# EAGLE schematic wifilights-probe-board (EAGLE 7.2.0)
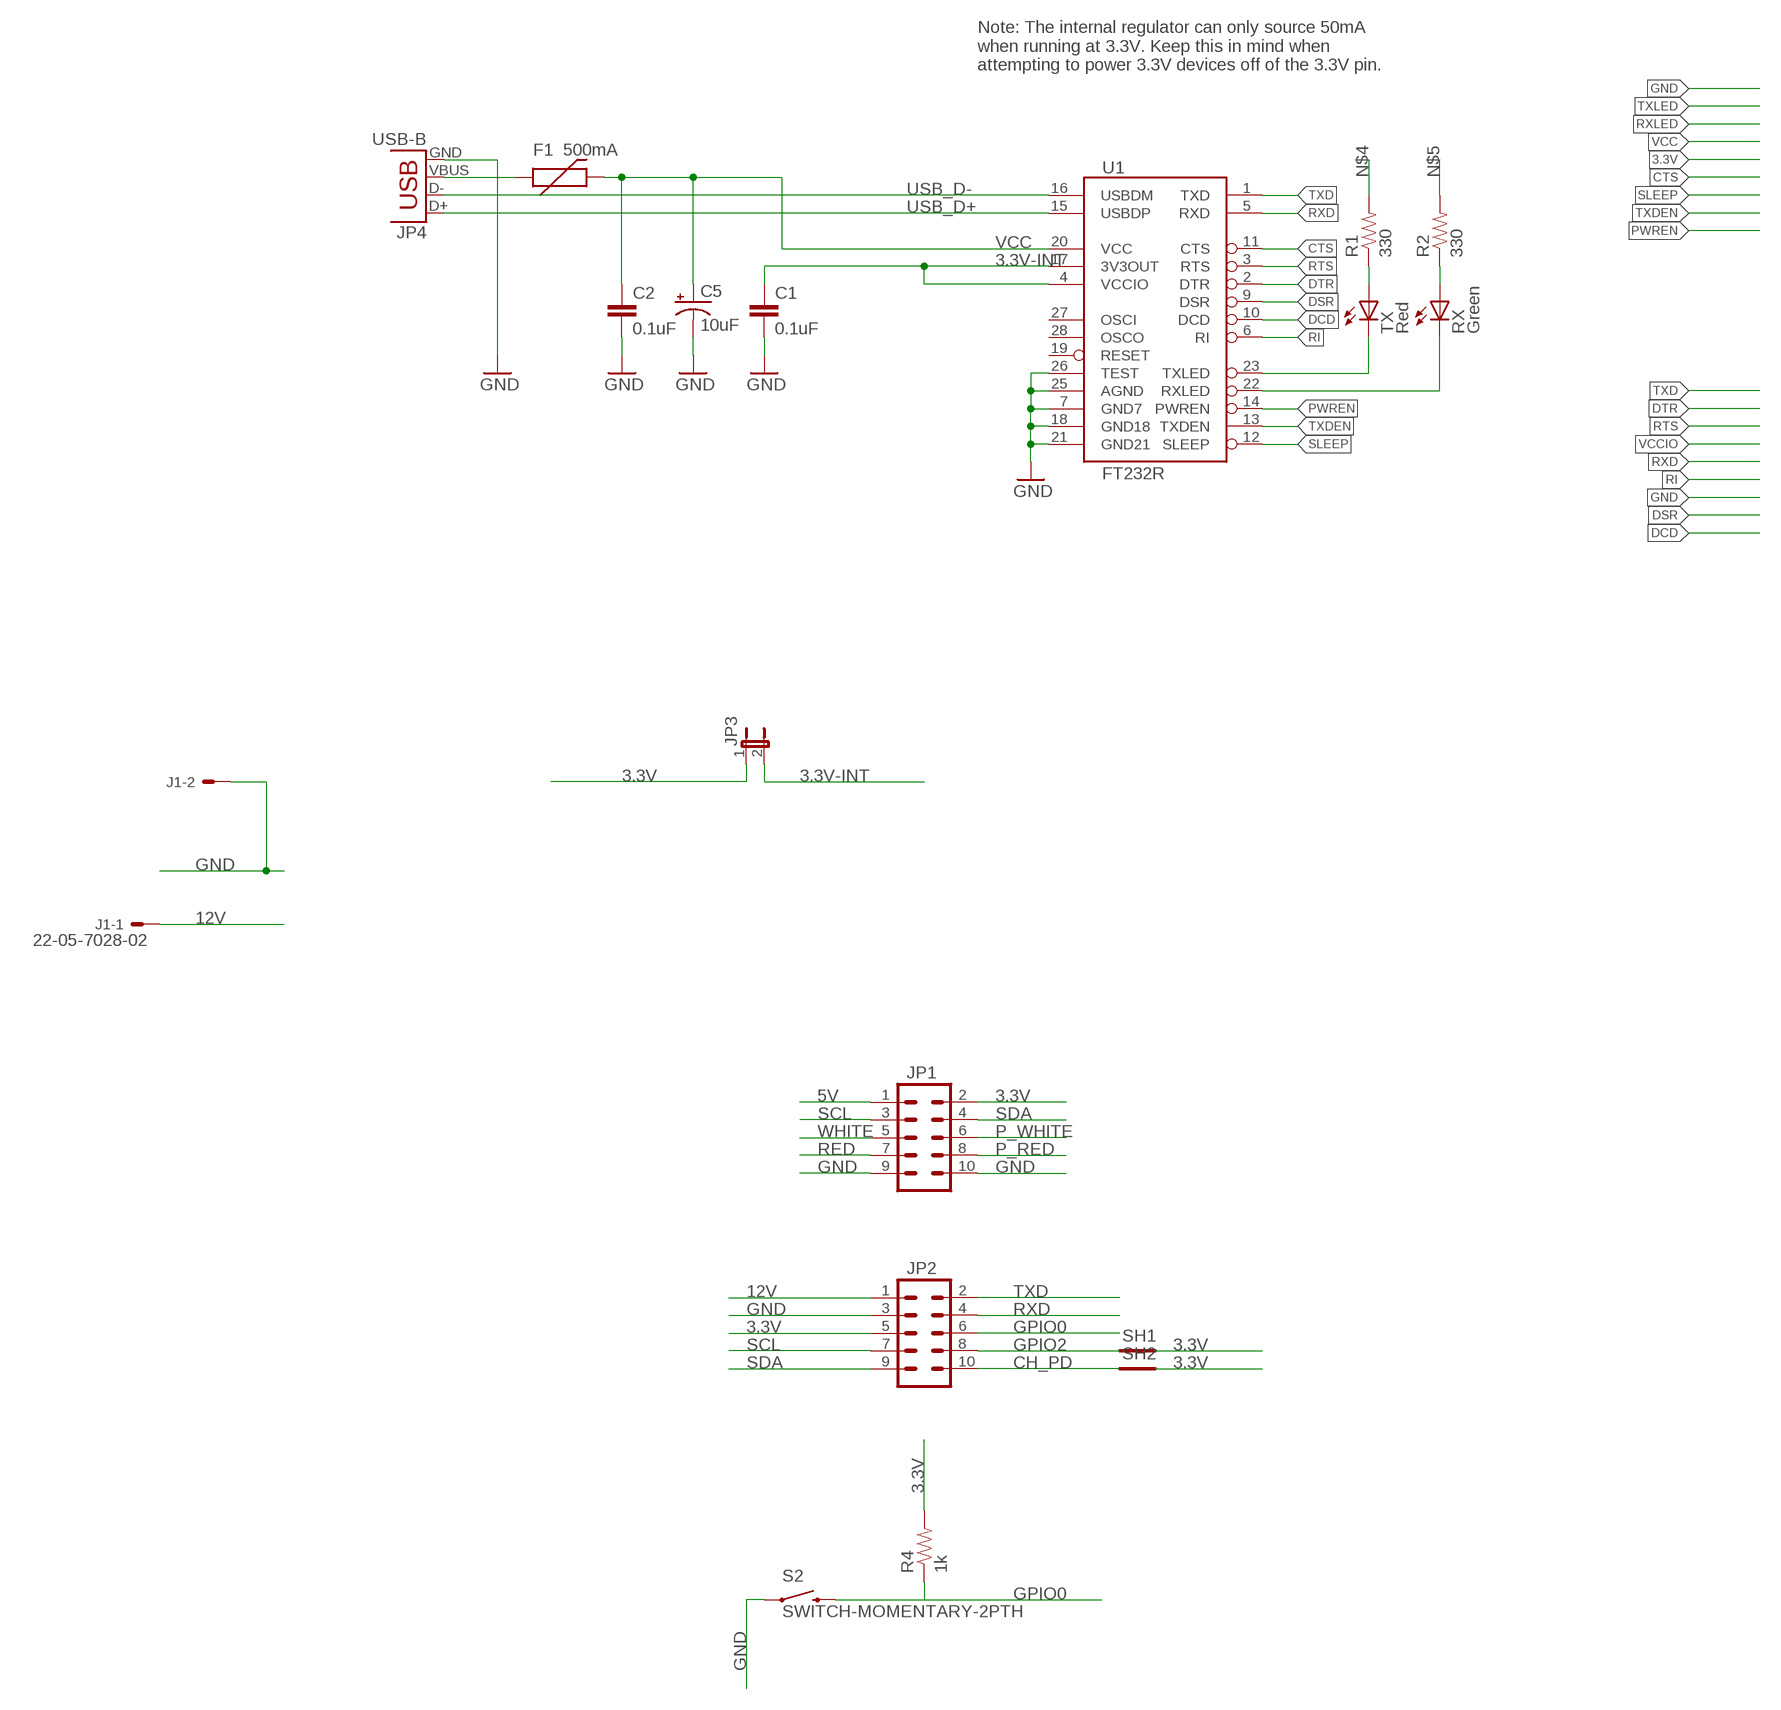
[diagram p0: schematic, sheet 1]

## Parts
C1  0.1uF  0.1UF-25V(+80/-20%)(0603)  [0603-CAP]
C2  0.1uF  0.1UF-25V(+80/-20%)(0603)  [0603-CAP]
C5  10uF  10UF-16V-10%(TANT)  [EIA3216]
F1  500mA  PTCSMD  [PTC-1206]
J1  22-05-7028-02  [7395-02]
JP1  M05X2SHD  [2X5-SHROUDED]
JP2  M05X2SHD_LOCK  [2X5-SHROUDED_LOCK]
JP3  JUMPER-2PTH  [1X02]
JP4  USB-B  USBPTH  [USB-B-PTH]
R1  330  330OHM1/10W1%(0603)  [0603-RES]
R2  330  330OHM1/10W1%(0603)  [0603-RES]
R4  1k  RESISTORAXIAL-0.3  [AXIAL-0.3]
RX  Green  LED-GREEN0603  [LED-0603]
S2  SWITCH-MOMENTARY-2PTH  [TACTILE-PTH]
SH1  SHORT-HT5  [SHORT_TOP-50]
SH2  SHORT-HT5  [SHORT_TOP-50]
TX  Red  LED-RED0603  [LED-0603]
U1  FT232R  FT232RLSSOP  [SSOP28DB]

## Nets
3.3V: JP1.2 JP2.5 JP3.1 R4.P$2 SH1.2 SH2.2
3.3V-INT: C1.1 JP3.2 U1.4(VCCIO) U1.17(3V3OUT)
5V: JP1.1
12V: J1.1 JP2.1
CH_PD: JP2.10 SH2.1
CTS: U1.11(CTS)
DCD: U1.10(DCD)
DSR: U1.9(DSR)
DTR: U1.2(DTR)
GND: C1.2 C2.2 C5.C(-) J1.2 JP1.9 JP1.10 JP2.3 JP4.GND S2.1 U1.7(GND7) U1.18(GND18) U1.21(GND21) U1.25(AGND) U1.26(TEST)
GPIO0: JP2.6 R4.P$1 S2.3
GPIO2: JP2.8 SH1.1
N$1: R1.1 TX.A
N$2: R2.1 RX.A
N$3: F1.1 JP4.VBUS
N$4: R1.2
N$5: R2.2
P_RED: JP1.8
P_WHITE: JP1.6
PWREN: U1.14(PWREN)
RED: JP1.7
RI: U1.6(RI)
RTS: U1.3(RTS)
RXD: JP2.4 U1.5(RXD)
RXLED: RX.C U1.22(RXLED)
SCL: JP1.3 JP2.7
SDA: JP1.4 JP2.9
SLEEP: U1.12(SLEEP)
TXD: JP2.2 U1.1(TXD)
TXDEN: U1.13(TXDEN)
TXLED: TX.C U1.23(TXLED)
USB_D+: JP4.D+ U1.15(USBDP)
USB_D-: JP4.D- U1.16(USBDM)
VCC [power]: C2.1 C5.A(+) F1.2 U1.20(VCC)
WHITE: JP1.5
Unconnected: U1.19(RESET) U1.27(OSCI) U1.28(OSCO)

## Notes on the sheet
- Note: The internal regulator can only source 50mA
  when running at 3.3V. Keep this in mind when
  attempting to power 3.3V devices off of the 3.3V pin.

## Library data of the parts
C1 C2 = SparkFun-Capacitors:0.1UF-25V(+80/-20%)(0603): CAP-00810 Ceramic Standard decoupling cap; PROD_ID: CAP-00810
C5 = SparkFun-Capacitors:10UF-16V-10%(TANT): CAP-00811 1206/EIA-3216 Tantalum capacitor; PROD_ID: CAP-00811
F1 = SparkFun:PTC: Resettable Fuse PTC Resettable Fuse. Spark Fun Electronics SKU : COM-08357
J1 = con-molex:22-?-02: CONNECTOR wire to board 2.54 mm (.1 inch) pitch header; OC_FARNELL: 9731601; OC_NEWARK: unknown
JP1 JP2 = SparkFun-Connectors:M05X2: Header 5x2 Standard 10-pin dual row 0.1" header. Commonly used with AVR-ISP. Use with Spark Fun Electronics SKU: PRT-00778
JP3 = SparkFun-Retired:JUMPER-2: Jumper Basic 0.1" spaced jumper. Use with breakaway headers.
JP4 = SparkFun-Connectors:USB: USB Connectors USB-B-PTH is fully proven SKU : PRT-00139/CONN-08278 USB-miniB is fully proven SKU : PRT-00587 USB-A-PCB is untested. USB-A-H is throughly reviewed, but untested. Spark Fun Electronics SKU : PRT-00437 USB-B-SMT is throughly reviewed, but untested. Needs silkscreen touching up. USB-A-S has not been used/tested USB-MB-H has not been used/tested USB-MICROB has been used. CONN-09505; PROD_ID: CONN-08278
R1 R2 = SparkFun-Resistors:330OHM1/10W1%(0603): RES-00818; PROD_ID: RES-00818
R4 = SparkFun-Passives:RESISTOR: Resistor Basic schematic elements and footprints for 0603, 1206, and PTH resistors.
RX = SparkFun-LED:LED-GREEN: Various green LEDs 0603- DIO-00821 LARGE- DIO-00862 LILYPAD- DIO-09910; PROD_ID: DIO-00821; VALUE: GREEN
S2 = SparkFun-Electromechanical:SWITCH-MOMENTARY-2: Various NO switches- pushbuttons, reed, etc
SH1 SH2 = shorts-old:SHORT-H: Short between two nets; BOM: no
TX = SparkFun-LED:LED-RED: Assorted Red LEDs LilyPad 1206- DIO-09912 1206- DIO-00809 0603- DIO-00819; PROD_ID: DIO-00819; VALUE: RED
U1 = SparkFun:FT232RL: USB UART FT232RL 4th Generation USB UART (USB <-> Serial) Controller. Spark Fun Electronics SKU : COM-00650

## Net classes
1 power: width 0.254 mm